# EAGLE design Main (EAGLE 6.5.0)
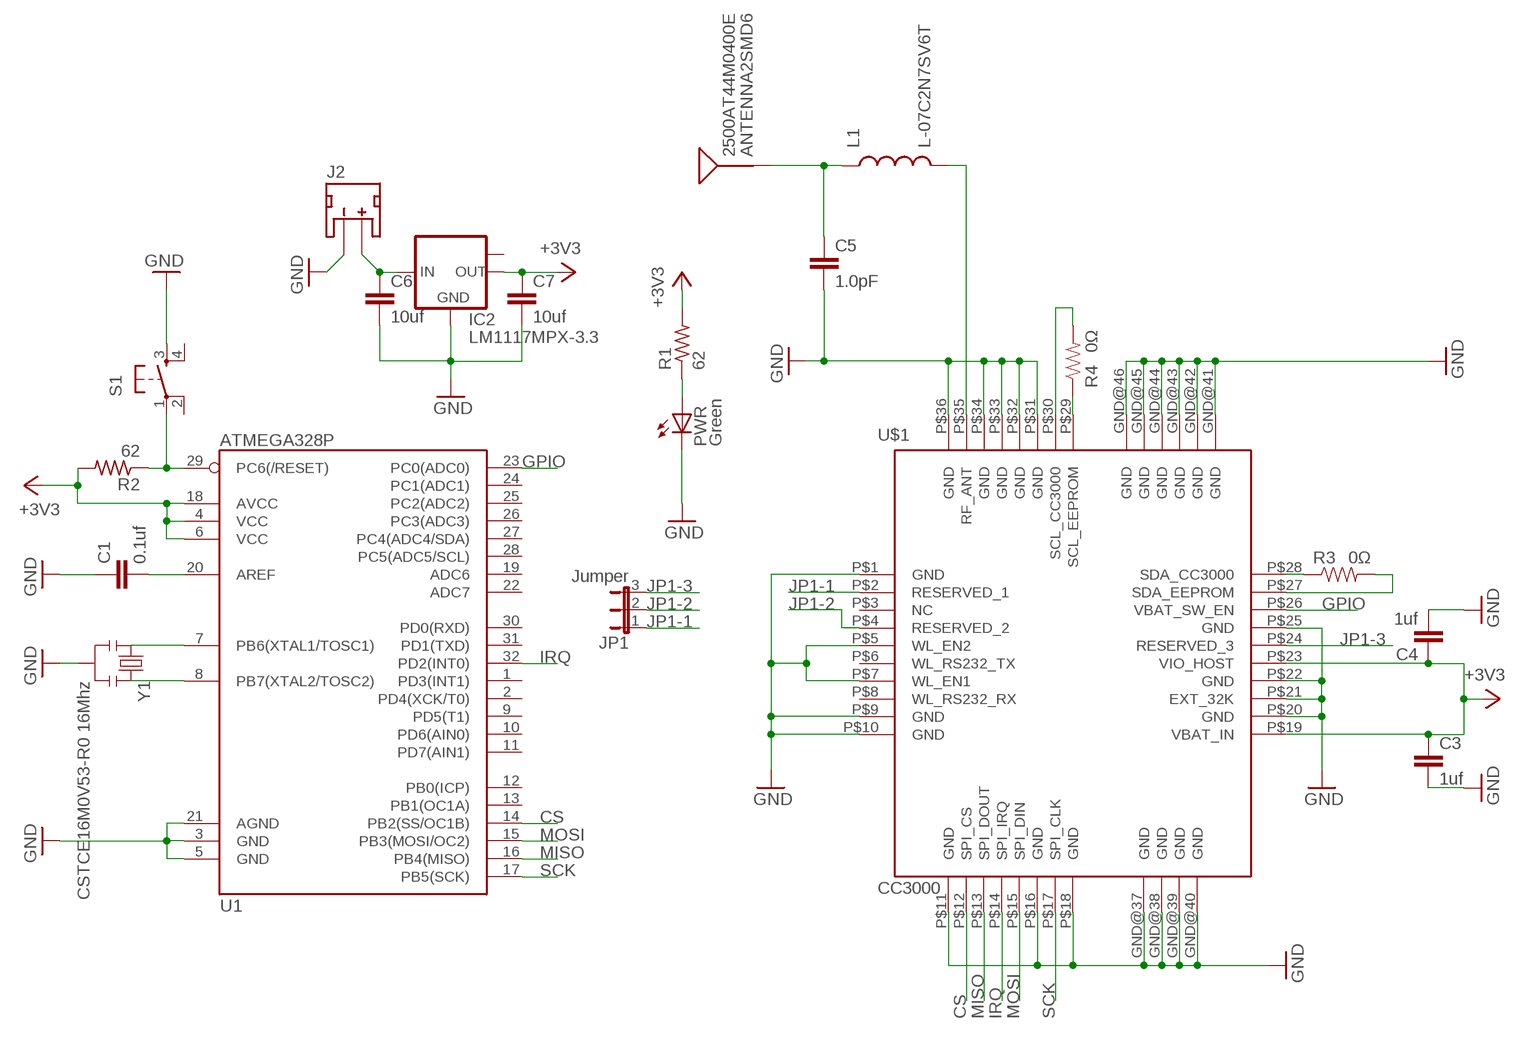
[diagram p0: schematic, sheet 1]

## Parts
2500AT44M0400E  ANTENNA2SMD6  [ANTENNA-CHIP6]
C1  0.1uf  C-EUC0805  [C0805]
C3  1uf  C-EUC0805  [C0805]
C4  1uf  C-EUC0805  [C0805]
C5  1.0pF  1.0PF-50V(-/+.25PF)(0603)  [0603-CAP]
C6  10uf  C-EUC0805  [C0805]
C7  10uf  C-EUC0805  [C0805]
IC2  LM1117MPX-3.3  [SOT223]
J2  JST_2MM_MALE  [JST-2-SMD]
JP1  Jumper  JP2E  [JP2]
L1  L-07C2N7SV6T  INDUCTOR0402  [C0402]
PWR  Green  LEDCHIPLED_1206  [CHIPLED_1206]
R1  62  R-US_R0805  [R0805]
R2  62  R-US_R0805  [R0805]
R3  0Ω  RESISTOR0603-RES  [0603-RES]
R4  0Ω  RESISTOR0603-RES  [0603-RES]
S1  TAC_SWITCHSMD  [TACTILE_SWITCH_SMD]
U1  ATMEGA328P  ATMEGA328_SMT  [TQFP32-08]
U$1  CC3000  [QFN-46_CC3000]
Y1  CSTCE16M0V53-R0 16Mhz  RESONATOR16MHZ  [RESONATOR-SMD]

## Nets
+3V3: C3.1 C4.1 R1.2 R2.2 U1.4(VCC) U1.6(VCC) U1.18(AVCC) U$1.P$19(VBAT_IN) U$1.P$23(VIO_HOST)
CS: U1.14(PB2(SS/OC1B)) U$1.P$12(SPI_CS)
GND: C1.1 C3.2 C4.2 C5.2 C6.2 C7.2 IC2.1(GND) J2.1(-) PWR.C S1.3 U1.3(GND) U1.5(GND) U1.21(AGND) U$1.GND@37(GND) U$1.GND@40(GND) U$1.GND@41(GND) U$1.GND@42(GND) U$1.GND@43(GND) U$1.GND@44(GND) U$1.GND@45(GND) U$1.GND@46(GND) U$1.P$1(GND) U$1.P$5(WL_EN2) U$1.P$7(WL_EN1) U$1.P$10(GND) U$1.P$11(GND) U$1.P$16(GND) U$1.P$20(GND) U$1.P$21(EXT_32K) U$1.P$22(GND) U$1.P$25(GND) U$1.P$31(GND) U$1.P$32(GND) U$1.P$33(GND) U$1.P$34(GND) U$1.P$36(GND) Y1.2
GPIO: U1.23(PC0(ADC0)) U$1.P$26(VBAT_SW_EN)
IN: C6.1 IC2.3(IN) J2.2(+)
IRQ: U1.32(PD2(INT0)) U$1.P$14(SPI_IRQ)
JP1-1: JP1.1 U$1.P$2(RESERVED_1)
JP1-2: JP1.2 U$1.P$4(RESERVED_2)
JP1-3: JP1.3 U$1.P$24(RESERVED_3)
MISO: U1.16(PB4(MISO))
MOSI: U1.15(PB3(MOSI/OC2)) U$1.P$15(SPI_DIN)
N$1: PWR.A R1.1
N$2: U1.8(PB7(XTAL2/TOSC2)) Y1.3
N$3: U1.7(PB6(XTAL1/TOSC1)) Y1.1
N$4: C1.2 U1.20(AREF)
N$6: L1.2 U$1.P$35(RF_ANT)
N$8: R3.2 U$1.P$27(SDA_EEPROM)
N$9: R3.1 U$1.P$28(SDA_CC3000)
N$10: R4.1 U$1.P$29(SCL_EEPROM)
N$11: R4.2 U$1.P$30(SCL_CC3000)
N$12: 2500AT44M0400E.1(SIGNAL) C5.1 L1.1
OUT: C7.1 IC2.2(OUT) ; supply symbol labelled +3V3
RESET: R2.1 S1.1 U1.29(PC6(/RESET))
SCK: U1.17(PB5(SCK)) U$1.P$17(SPI_CLK)
Unconnected: IC2.TAB(OUT1) J2.NC1(PAD1) J2.NC2(PAD2) S1.2 S1.4 U1.1(PD3(INT1)) U1.2(PD4(XCK/T0)) U1.9(PD5(T1)) U1.10(PD6(AIN0)) U1.11(PD7(AIN1)) U1.12(PB0(ICP)) U1.13(PB1(OC1A)) U1.19(ADC6) U1.22(ADC7) U1.24(PC1(ADC1)) U1.25(PC2(ADC2)) U1.26(PC3(ADC3)) U1.27(PC4(ADC4/SDA)) U1.28(PC5(ADC5/SCL)) U1.30(PD0(RXD)) U1.31(PD1(TXD)) U$1.GND@38(GND) U$1.GND@39(GND) U$1.P$3(NC) U$1.P$6(WL_RS232_TX) U$1.P$8(WL_RS232_RX) U$1.P$9(GND) U$1.P$13(SPI_DOUT) U$1.P$18(GND)

## Library data of the parts
2500AT44M0400E = SparkFun-RF:ANTENNA2: Chip antenna Single endded antenna. Common with smaller chip antennas. CHIP4 package is the GPS Chip Antenna SKU: GPS-08418. CHIP5 package is 2.4GHz chip antenna SKU: WRL-00144.
C1 C3 C4 C6 C7 = rcl:C-EU: CAPACITOR, European symbol
C5 = SparkFun-Capacitors:1.0PF-50V(-/+.25PF)(0603): CAP-07879; PROD_ID: CAP-07879
IC2 = lm1117:LM1117MPX-*
J2 = SparkFun-Connectors:JST_2MM_MALE: Mates to single-cell LiPo batteries. CONN-08352; PROD_ID: CONN-08352
JP1 = jumper:JP2E: JUMPER
L1 = SparkFun-Passives:INDUCTOR: Inductors Basic Inductor/Choke - 0603 and 1206. Footprints are not proven and vary greatly between part numbers. SRN6045- 33uH, 20% 1.4A SDR0403-560KL - 56uH, 10%, 500mA RMS/740mA peak
PWR = adafruit:LED: LED OSRAM: - CHIPLED LG R971, LG N971, LY N971, LG Q971, LY Q971, LO R971, LY R971 LH N974, LH R974 LS Q976, LO Q976, LY Q976 LO Q996 - Hyper CHIPLED LW Q18S LB Q993, LB Q99A, LB R99A - SideLED LS A670, LO A670, LY A670, LG A670, LP A670 LB A673, LV A673, LT A673, LW A673 LH A674 LY A675 LS A676, LA A676, LO A676, LY A676, LW A676 LS A679, LY A679, LG A679 - Hyper Micro SIDELED® LS Y876, LA Y876, LO Y876, LY Y876 LT Y87S - SmartLED LW L88C, LW L88S LB L89C, LB L89S, LG L890 LS L89K, LO L89K, LY L89K LS L896, LA L896, LO L896, LY L896 - TOPLED LS T670, LO T670, LY T670, LG T670, LP T670 LSG T670, LSP T670, LSY T670, LOP T670, LYG T670 LG T671, LOG T671, LSG T671 LB T673, LV T673, LT T673, LW T673 LH T674 LS T676, LA T676, LO T676, LY T676, LB T676, LH T676, LSB T676, LW T676 LB T67C, LV T67C, LT T67C, LS T67K, LO T67K, LY T67K, LW E67C LS E67B, LA E67B, LO E67B, LY E67B, LB E67C, LV E67C, LT E67C LW T67C LS T679, LY T679, LG T679 LS T770, LO T770, LY T770, LG T770, LP T770 LB T773, LV T773, LT T773, LW T773 LH T774 LS E675, LA E675, LY E675, LS T675 LS T776, LA T776, LO T776, LY T776, LB T776 LHGB T686 LT T68C, LB T68C - Hyper Mini TOPLED® LB M676 - Mini TOPLED Santana® LG M470 LS M47K, LO M47K, LY M47K Source: http://www.osram.convergy.de/
R1 R2 = adafruit:R-US_: RESISTOR, American symbol
R3 R4 = SparkFun-Passives:RESISTOR: Resistor Basic schematic elements and footprints for 0603, 1206, and PTH resistors.
S1 = SparkFun-Electromechanical:TAC_SWITCH: Momentary Switch Button commonly used for reset or general input. Spark Fun Electronics SKU : COM-00097 SMT- SWCH-08247; PROD_ID: SWCH-08247
U1 = SparkFun-DigitalIC:ATMEGA328_SMT: 32-Pin Atmega328 part Commonly used on Arduino compatible boards Available in QFP and QFN packages TQFP is IC-09069 QFN is non-stock; PROD_ID: IC-09069
U$1 = SparkFun-RF:CC3000: TI CC3000 WiFi Module
Y1 = SparkFun-FreqCtrl:RESONATOR: Resonator Small SMD resonator. Used, eg, on the Arduino Pro/ Pro Mini boards. 8MHz- XTAL-08895 16MHz- XTAL-08900; PROD_ID: XTAL-08900; VALUE: 16MHz

## Board
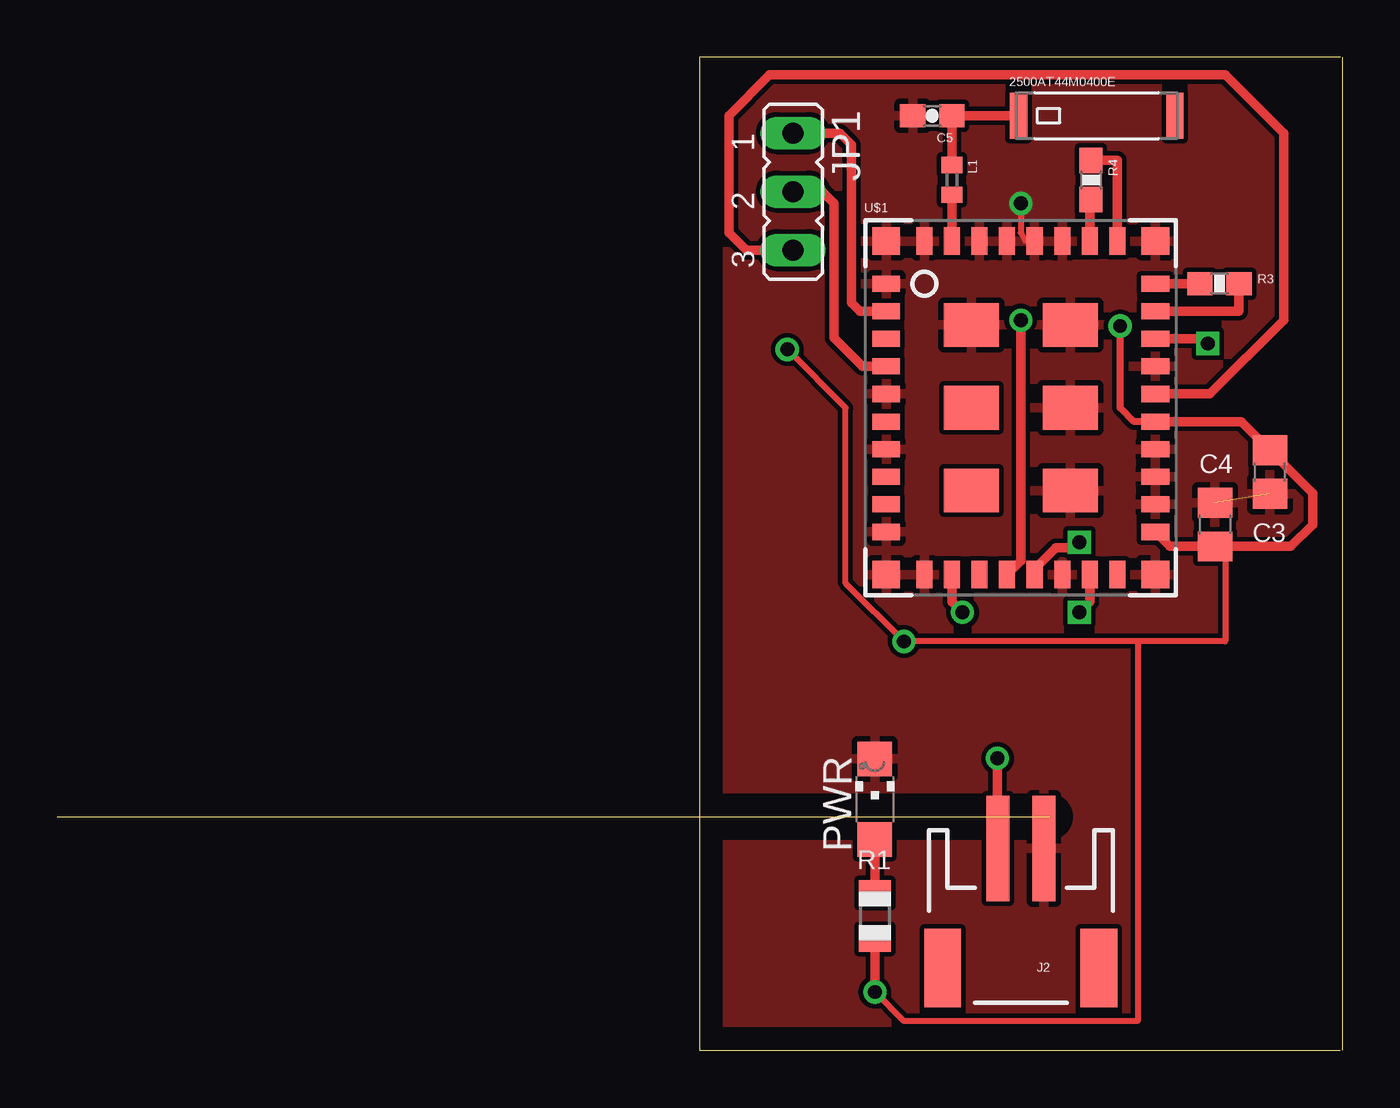
[diagram p1: board, top side]
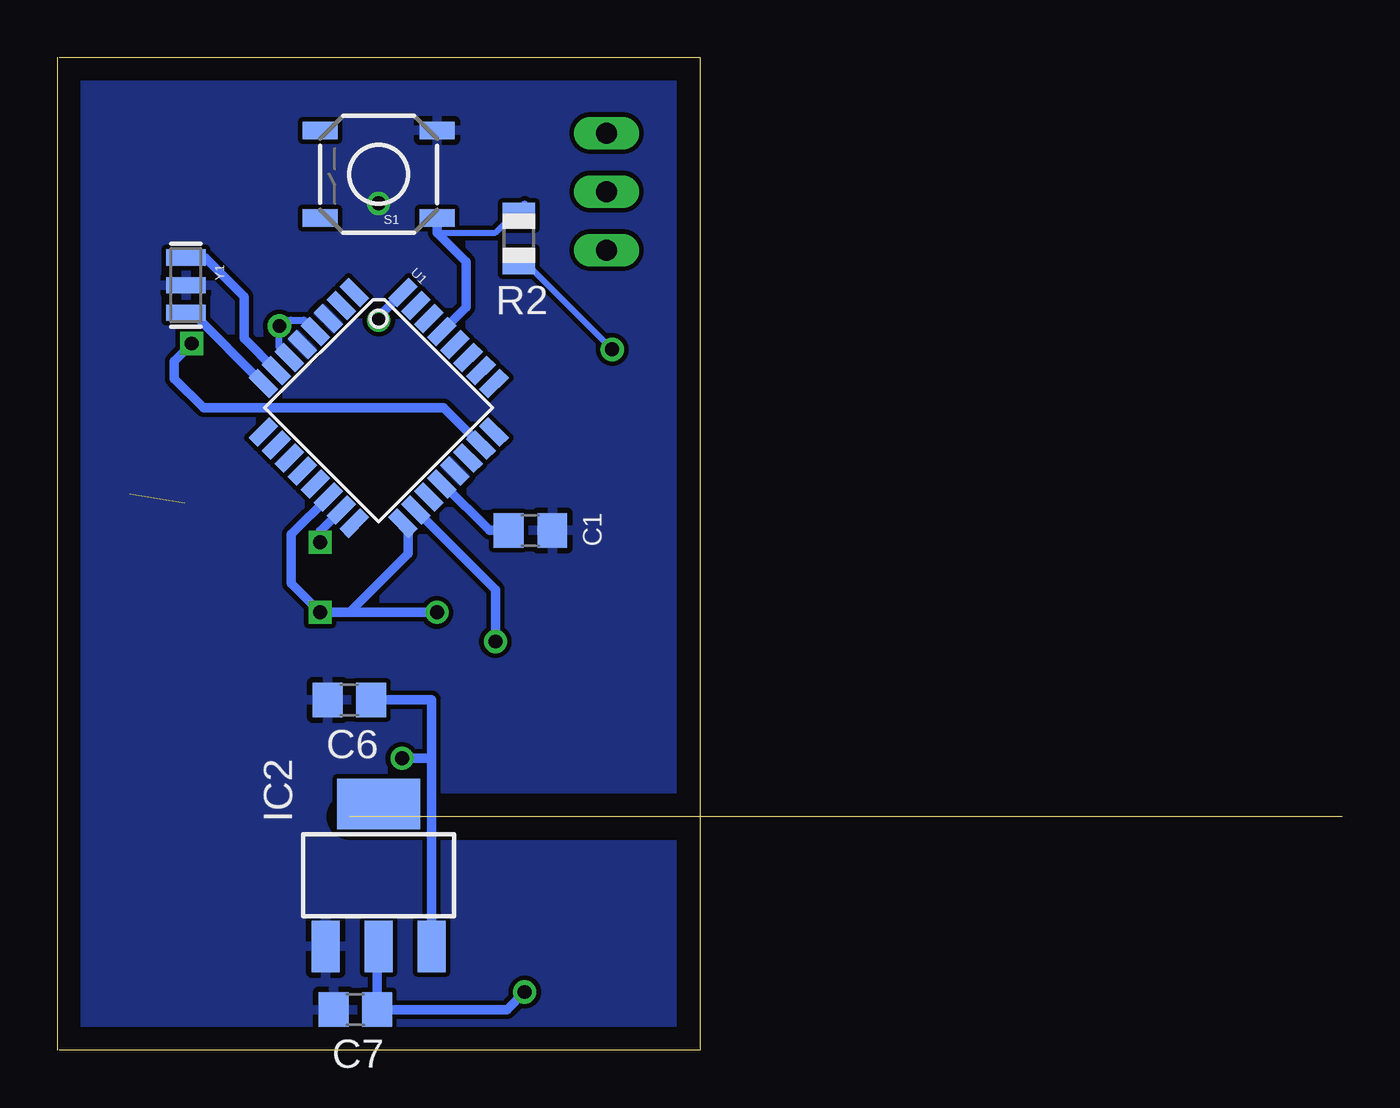
[diagram p2: board, bottom side, seen from below]

Size 55.87 x 43.17 mm. Coordinates in mm from the lower left corner, seen from the top.
Outline: 55.79,0 27.93,0 27.93,43.17 55.79,43.17
Outline: 0,10.16 43.17,10.16
Outline: 55.87,43.17 55.87,0
Copper layers (1*16): Top 0.035mm / dielectric 1.5mm / Bottom 0.035mm
Design rules "default": minimum track width 10mil, minimum drill 24mil, track to track 8mil, track to pad 8mil, pad to pad 8mil, via to via 8mil, smd to smd 8mil, copper to edge 40mil, drill to drill 8mil, minimum pad ring 10mil, minimum via ring 8mil, stop-mask expansion 4mil, vias tented up to drill 0mil, thermal gap 10mil

### Footprints (pad centres in the part's own frame; a part is rotated, then mirrored left to right if it is on the bottom)
ANTENNA-CHIP6 = smd 0.75 x 2: 1 -3.4,0; NC 3.4,0
C0805 = smd 1.3 x 1.5: 1 -0.95,0; 2 0.95,0
0603-CAP = smd 1.1 x 1: 1 -0.85,0; 2 0.85,0
SOT223 = smd 1.219 x 2.235: 1 -2.311,-3.099; 2 0,-3.099; 3 2.311,-3.099 | smd 3.6 x 2.2: TAB 0,3.099
JST-2-SMD = smd 1 x 4.6: 1 -1,-3.7; 2 1,-3.7 | smd 1.6 x 3.4: NC1 -3.4,1.5; NC2 3.4,1.5
JP2 = drill 0.914 long: 1 -2.54,0; 2 0,0; 3 2.54,0
C0402 = smd 0.7 x 0.9: 1 -0.65,0; 2 0.65,0
CHIPLED_1206 = smd 1.5 x 1.5: A 0,-1.75; C 0,1.75
R0805 = smd 1.1 x 1.4: 1 -1,0; 2 1,0
0603-RES = smd 1.1 x 1: 1 -0.85,0; 2 0.85,0
TACTILE_SWITCH_SMD = smd 1.524 x 0.762: 1 -2.54,1.905; 2 2.54,1.905; 3 -2.54,-1.905; 4 2.54,-1.905
TQFP32-08 = smd 1.27 x 0.559: 1 -4.293,2.8; 2 -4.293,2; 3 -4.293,1.2; 4 -4.293,0.4; 5 -4.293,-0.4; 6 -4.293,-1.2; 7 -4.293,-2; 8 -4.293,-2.8; 17 4.293,-2.8; 18 4.293,-2; 19 4.293,-1.2; 20 4.293,-0.4; 21 4.293,0.4; 22 4.293,1.2; 23 4.293,2; 24 4.293,2.8 | smd 0.559 x 1.27: 9 -2.8,-4.293; 10 -2,-4.293; 11 -1.2,-4.293; 12 -0.4,-4.293; 13 0.4,-4.293; 14 1.2,-4.293; 15 2,-4.293; 16 2.8,-4.293; 25 2.8,4.293; 26 2,4.293; 27 1.2,4.293; 28 0.4,4.293; 29 -0.4,4.293; 30 -1.2,4.293; 31 -2,4.293; 32 -2.8,4.293
QFN-46_CC3000 = smd 2.4 x 1.9: GND@37 -2.15,3.6; GND@38 -2.15,0; GND@39 -2.15,-3.6; GND@40 2.15,3.6; GND@41 2.15,0; GND@42 2.15,-3.6 | smd 1.2 x 1.2: GND@43 -5.85,7.25; GND@44 -5.85,-7.25; GND@45 5.85,-7.25; GND@46 5.85,7.25 | smd 1.2 x 0.7: P$1 -5.85,5.4; P$2 -5.85,4.2; P$3 -5.85,3; P$4 -5.85,1.8; P$5 -5.85,0.6; P$6 -5.85,-0.6; P$7 -5.85,-1.8; P$8 -5.85,-3; P$9 -5.85,-4.2; P$10 -5.85,-5.4; P$19 5.85,-5.4; P$20 5.85,-4.2; P$21 5.85,-3; P$22 5.85,-1.8; P$23 5.85,-0.6; P$24 5.85,0.6; P$25 5.85,1.8; P$26 5.85,3; P$27 5.85,4.2; P$28 5.85,5.4 | smd 0.7 x 1.2: P$11 -4.2,-7.25; P$12 -3,-7.25; P$13 -1.8,-7.25; P$14 -0.6,-7.25; P$15 0.6,-7.25; P$16 1.8,-7.25; P$17 3,-7.25; P$18 4.2,-7.25; P$29 4.2,7.25; P$30 3,7.25; P$31 1.8,7.25; P$32 0.6,7.25; P$33 -0.6,7.25; P$34 -1.8,7.25; P$35 -3,7.25; P$36 -4.2,7.25
RESONATOR-SMD = smd 0.7 x 1.7: 1 -1.2,0; 2 0,0; 3 1.2,0

### Placement (x,y rotation side)
2500AT44M0400E  45.2,40.64 0 top
C1  35.3,22.61 180 bottom
C3  52.73,25.15 270 top
C4  50.35,22.86 90 top
C5  38.05,40.64 180 top
C6  43.17,15.24 180 bottom
C7  42.92,1.78 180 bottom
IC2  41.9,7.62 0 bottom
J2  41.9,5.08 180 top
JP1  31.99,37.34 270 top
L1  38.9,37.85 270 top
PWR  35.55,10.92 0 top
R1  35.55,5.84 270 top
R2  35.8,35.31 270 bottom
R3  50.54,33.34 0 top
R4  44.95,37.85 270 top
S1  41.9,38.1 180 bottom
U1  41.9,27.94 315 bottom
U$1  41.9,27.94 0 top
Y1  50.28,33.27 270 bottom

### Tracks (layer width: path | path; a pad name or v marks a point on that pad's centre or on a via)
+3V3  (via drill 0.6, 0.61)
  Top 0.254: v31.74,30.48 34.28,27.94 34.28,20.32 v36.82,17.78 46.98,17.78 | 46.98,17.78 50.79,17.78 50.79,21.59 C4.1 | v35.55,2.54 36.82,1.27 46.98,1.27 46.98,17.78
  Top 0.305: U$1.P$23 46.82,27.34 46.22,27.94 v46.22,31.5
  Top 0.406: U$1.P$23 51.49,27.34 C3.1 54.6,24.23 54.6,22.86 53.65,21.91 C4.1 48.38,21.91 U$1.P$19 | R1.2 v35.55,2.54
  Bottom 0.254: v31.74,30.48 35.55,34.29 R2.2
  Bottom 0.305: U1.4 45.14,31.75 45.71,31.75 45.96,31.75 v46.22,31.5 46.22,30.56 U1.6
  Bottom 0.406: 42.15,1.52 41.9,1.78 36.31,1.78 v35.55,2.54 | U1.18 36.82,20.03 v36.82,17.78
CS  (via drill 0.6)
  Top 0.406: U$1.P$12 38.9,19.51 v39.36,19.05
  Bottom 0.406: v39.36,19.05 44.44,19.05 45.71,20.32 45.71,22.43 U1.14
GND  (via drill 0.61)  (1 unrouted)
  Top 0.254: v41.9,36.83 41.9,35.56 42.11,35.19
  pour Top: 26.66,43.18 26.66,-1.27 57.14,-1.27 57.14,0 57.14,44.45 26.66,44.45
  pour Bottom: 26.66,44.45 26.66,-1.27 57.14,-1.27 57.14,44.45
GPIO  (via drill 0.6)
  Top 0.406: v50.03,30.73 49.82,30.94 U$1.P$26
  Bottom 0.406: U1.23 39.07,27.94 49.52,27.94 50.79,29.21 50.79,29.97 v50.03,30.73
IN  (via drill 0.6)
  Top 0.406: v40.88,12.7 40.88,10.05 J2.2
  Bottom 0.406: IC2.3 39.59,12.7 | 39.59,12.7 39.59,15.24 C6.1 | v40.88,12.7 39.59,12.7
IRQ  (via drill 0.6)
  Top 0.406: U$1.P$14 41.9,21.29 v41.9,31.75
  Bottom 0.406: v41.9,31.75 41.9,31.9 U1.32
JP1-1
  Top 0.406: JP1.1 34.03,39.88 34.53,39.37 34.53,32.51 34.91,32.14 U$1.P$2
JP1-2
  Top 0.406: U$1.P$4 35.02,29.74 33.77,30.99 33.77,36.83 33.26,37.34 JP1.2
JP1-3
  Top 0.406: JP1.3 29.96,34.8 29.2,35.56 29.2,40.64 30.98,42.42 50.79,42.42 53.33,39.88 53.33,31.75 50.12,28.54 U$1.P$24
MOSI  (via drill 0.6)
  Top 0.406: v44.44,22.1 44.19,21.84 43.42,21.84 42.5,20.92 U$1.P$15
  Bottom 0.406: U1.15 44.44,22.57 v44.44,22.1
N$1
  Top 0.406: R1.1 PWR.A
N$2
  Bottom 0.406: U1.8 49.99,32.07 Y1.3
N$3
  Bottom 0.406: U1.7 47.74,30.95 47.74,32.77 49.45,34.47 Y1.1
N$4
  Bottom 0.406: U1.20 39.09,24.62 37.07,22.61 C1.2
N$6
  Top 0.406: U$1.P$35 L1.2
N$8
  Top 0.406: U$1.P$27 51.39,32.14 R3.2
N$9
  Top 0.406: U$1.P$28 R3.1
N$10
  Top 0.406: R4.1 46.1,38.7 U$1.P$29
N$11
  Top 0.406: R4.2 44.9,37 U$1.P$30
N$12
  Top 0.406: 2500AT44M0400E.1 C5.1 L1.1
OUT
  Bottom 0.406: 41.9,1.84 C7.1 41.97,4.45 IC2.2
RESET
  Bottom 0.254: 39.36,35.56 36.82,35.56 35.55,36.83 R2.1
  Bottom 0.406: U1.29 38.09,32.32 38.09,34.29 39.36,35.56 S1.1
SCK  (via drill 0.6)
  Top 0.406: U$1.P$17 44.9,19.51 v44.44,19.05
  Bottom 0.406: v44.44,19.05 43.17,19.05 40.63,21.59 40.63,22.71 U1.17